# Altium schematic sheet OUT.SchDoc
size A
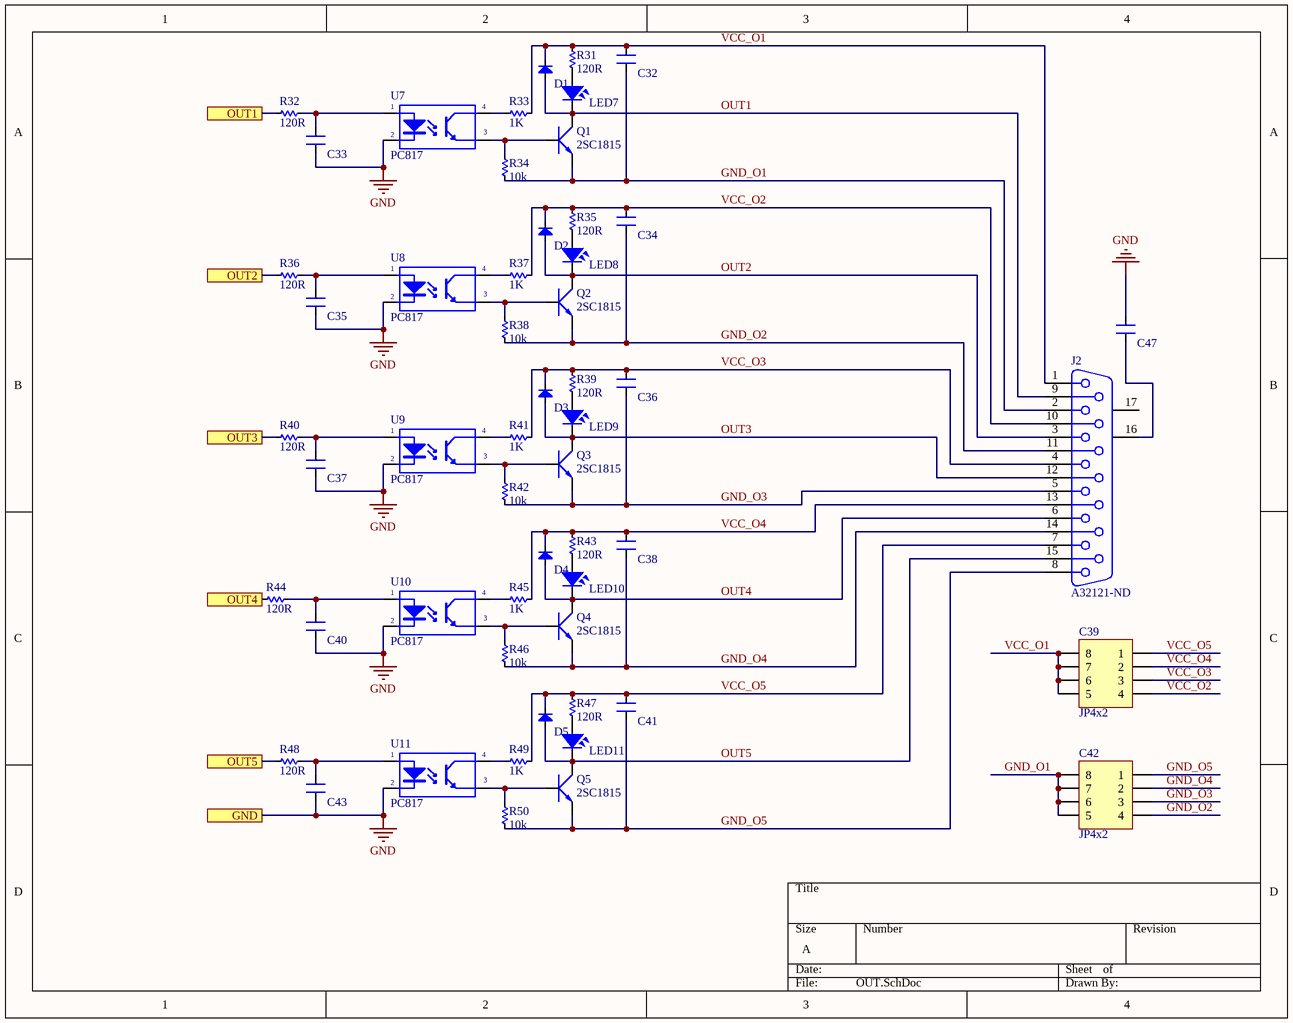
[diagram p0: OUT.SchDoc]

## Parts
C32  CN  [CN-SMD-0603_big]  (value not drawn)
C33  CN  [CN-SMD-0603_big]  (value not drawn)
C34  CN  [CN-SMD-0603_big]  (value not drawn)
C35  CN  [CN-SMD-0603_big]  (value not drawn)
C36  CN  [CN-SMD-0603_big]  (value not drawn)
C37  CN  [CN-SMD-0603_big]  (value not drawn)
C38  CN  [CN-SMD-0603_big]  (value not drawn)
C39  JP4x2  [JP4-D2T]
C40  CN  [CN-SMD-0603_big]  (value not drawn)
C41  CN  [CN-SMD-0603_big]  (value not drawn)
C42  JP4x2  [JP4-D2T]
C43  CN  [CN-SMD-0603_big]  (value not drawn)
C47  CN  [CN-SMD-0603_big]  (value not drawn)
D1  Diode  [DIO-SMD-106-HayDung]  (value not drawn)
D2  Diode  [DIO-SMD-106-HayDung]  (value not drawn)
D3  Diode  [DIO-SMD-106-HayDung]  (value not drawn)
D4  Diode  [DIO-SMD-106-HayDung]  (value not drawn)
D5  Diode  [DIO-SMD-106-HayDung]  (value not drawn)
J2  A32121-ND  [DB15]
LED7  LED  [LED-0805-Red]  (value not drawn)
LED8  LED  [LED-0805-Red]  (value not drawn)
LED9  LED  [LED-0805-Red]  (value not drawn)
LED10  LED  [LED-0805-Red]  (value not drawn)
LED11  LED  [LED-0805-Red]  (value not drawn)
Q1  2SC1815  [TO92-123]
Q2  2SC1815  [TO92-123]
Q3  2SC1815  [TO92-123]
Q4  2SC1815  [TO92-123]
Q5  2SC1815  [TO92-123]
R31  120R  [RES-SMD-0603_BIG]
R32  120R  [RES-SMD-0603_BIG]
R33  1K  [RES-SMD-0603_BIG]
R34  10k  [RES-SMD-0603_BIG]
R35  120R  [RES-SMD-0603_BIG]
R36  120R  [RES-SMD-0603_BIG]
R37  1K  [RES-SMD-0603_BIG]
R38  10k  [RES-SMD-0603_BIG]
R39  120R  [RES-SMD-0603_BIG]
R40  120R  [RES-SMD-0603_BIG]
R41  1K  [RES-SMD-0603_BIG]
R42  10k  [RES-SMD-0603_BIG]
R43  120R  [RES-SMD-0603_BIG]
R44  120R  [RES-SMD-0603_BIG]
R45  1K  [RES-SMD-0603_BIG]
R46  10k  [RES-SMD-0603_BIG]
R47  120R  [RES-SMD-0603_BIG]
R48  120R  [RES-SMD-0603_BIG]
R49  1K  [RES-SMD-0603_BIG]
R50  10k  [RES-SMD-0603_BIG]
U7  PC817  [PC817SMT]
U8  PC817  [PC817SMT]
U9  PC817  [PC817SMT]
U10  PC817  [PC817SMT]
U11  PC817  [PC817SMT]

## Ports
GND, OUT1, OUT2, OUT3, OUT4, OUT5

## Nets
GND: C33.1 C35.1 C37.1 C40.1 C43.1 C47.2 U7.2(K) U8.2(K) U9.2(K) U10.2(K) U11.2(K) ; port GND
GND_O1: C32.1 C42.5 C42.6 C42.7 C42.8 J2.2 Q1.1(E) R34.1
GND_O2: C34.1 C42.4 J2.11 Q2.1(E) R38.1
GND_O3: C36.1 C42.3 J2.5 Q3.1(E) R42.1
GND_O4: C38.1 C42.2 J2.14 Q4.1(E) R46.1
GND_O5: C41.1 C42.1 J2.8 Q5.1(E) R50.1
OUT1: R32.1 ; port OUT1
OUT1: D1.1(A) J2.9 LED7.2 Q1.2(C)  [a separate net that carries the same name]
OUT2: R36.1 ; port OUT2
OUT2: D2.1(A) J2.3 LED8.2 Q2.2(C)  [a separate net that carries the same name]
OUT3: R40.1 ; port OUT3
OUT3: D3.1(A) J2.12 LED9.2 Q3.2(C)  [a separate net that carries the same name]
OUT4: R44.1 ; port OUT4
OUT4: D4.1(A) J2.6 LED10.2 Q4.2(C)  [a separate net that carries the same name]
OUT5: R48.1 ; port OUT5
OUT5: D5.1(A) J2.15 LED11.2 Q5.2(C)  [a separate net that carries the same name]
VCC_O1: C32.2 C39.5 C39.6 C39.7 C39.8 D1.2(K) J2.1 R31.2 R33.2
VCC_O2: C34.2 C39.4 D2.2(K) J2.10 R35.2 R37.2
VCC_O3: C36.2 C39.3 D3.2(K) J2.4 R39.2 R41.2
VCC_O4: C38.2 C39.2 D4.2(K) J2.13 R43.2 R45.2
VCC_O5: C39.1 C41.2 D5.2(K) J2.7 R47.2 R49.2
NetC33_2: C33.2 R32.2 U7.1(A)
NetC35_2: C35.2 R36.2 U8.1(A)
NetC37_2: C37.2 R40.2 U9.1(A)
NetC40_2: C40.2 R44.2 U10.1(A)
NetC43_2: C43.2 R48.2 U11.1(A)
NetC47_1: C47.1 J2.16(MH1)
NetLED7_1: LED7.1 R31.1
NetLED8_1: LED8.1 R35.1
NetLED9_1: LED9.1 R39.1
NetLED10_1: LED10.1 R43.1
NetLED11_1: LED11.1 R47.1
NetQ1_3: Q1.3(B) R34.2 U7.3(E)
NetQ2_3: Q2.3(B) R38.2 U8.3(E)
NetQ3_3: Q3.3(B) R42.2 U9.3(E)
NetQ4_3: Q4.3(B) R46.2 U10.3(E)
NetQ5_3: Q5.3(B) R50.2 U11.3(E)
NetR33_1: R33.1 U7.4(C)
NetR37_1: R37.1 U8.4(C)
NetR41_1: R41.1 U9.4(C)
NetR45_1: R45.1 U10.4(C)
NetR49_1: R49.1 U11.4(C)

Not connected (* = marked no-connect by the designer): J2 17(MH2)

## Library data of the parts
C32-C38 C40 C41 C43 C47 = CN: Value: 33pF
C39 C42 = JP4x2: WR-PHD 2.54 mm Dual Socket Header; Manufacturer: W¨¹rth Elektronik eiSos GmbH; partNo: 61300821821; ComponentLink1 Description: Manufacturer; ComponentLink2 Description: Datasheet; NoPins: 08; Created Date: 29 March 2013; ComponentLink1URL: http://www.we-online.com; ComponentLink2URL: http://katalog.we-online.de/em/datasheet/6130xx21821.pdf; Created by: Karrer Zheng
D1-D5 = Diode: Default Diode; Code - JEDEC: DO-214-AB; Value: 1N5007; Published: 8-Jun-2000; Revision: July-2002: Re-released for DXP Platform.; Publisher: Altium Limited; ComponentLink1Description: ES1J - STMBL; ComponentLink1URL: https://banlinhkien.vn/goods-8089-es1j-do214-diode-1a-600v-sma-es1j-.html
J2 = DB15: Receptacle Assembly, 15 Position, Right Angle; PackageDocument: O; Positions: 15; Published: 15-Jun-2001; LatestRevisionDate: 17-Jul-2002; LatestRevisionNote: Re-released for DXP Platform.; DatasheetDocument: 1-Sep-99; PackageReference: 788757; Publisher: Altium Limited; Orientation: Right Angle; Gender: Receptacle
LED7-LED11 = LED SMD: Value: LED 3 - 5 ly 2 Colour
Q1-Q5 = 2SC1815: NPN 600mW, ECB; Value: C1815
R31-R50 = R
U7-U11 = PC817: Single Opto; Value: PC817